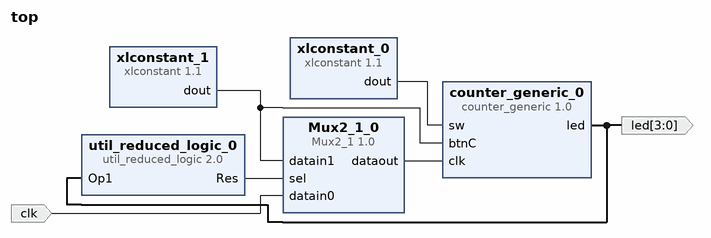
[diagram p0: block diagram of the top level]
# Vivado block design top, xc7a100tcsg324-3, Vivado 2016.4
create_bd_design top

create_bd_port -dir I clk
create_bd_port -dir O -from 3 -to 0 led

create_bd_cell -type ip -vlnv xilinx.com:user:counter_generic:1.0 counter_generic_0
create_bd_cell -type ip -vlnv xilinx.com:ip:xlconstant:1.1 xlconstant_0
set_property -dict {CONFIG.CONST_WIDTH 2} [get_bd_cells xlconstant_0]
create_bd_cell -type ip -vlnv xilinx.com:ip:xlconstant:1.1 xlconstant_1
set_property -dict {CONFIG.CONST_VAL 0} [get_bd_cells xlconstant_1]
create_bd_cell -type ip -vlnv xilinx.com:user:Mux2_1:1.0 Mux2_1_0
set_property -dict {CONFIG.number_of_bits 1} [get_bd_cells Mux2_1_0]
create_bd_cell -type ip -vlnv xilinx.com:ip:util_reduced_logic:2.0 util_reduced_logic_0
set_property -dict {CONFIG.C_SIZE 4} [get_bd_cells util_reduced_logic_0]

# ---- connections ----

connect_bd_net [get_bd_pins xlconstant_0/dout] [get_bd_pins counter_generic_0/sw]
connect_bd_net [get_bd_pins xlconstant_1/dout] [get_bd_pins counter_generic_0/btnC] [get_bd_pins Mux2_1_0/datain1]
connect_bd_net [get_bd_ports clk] [get_bd_pins Mux2_1_0/datain0]
connect_bd_net [get_bd_pins Mux2_1_0/dataout] [get_bd_pins counter_generic_0/clk]
connect_bd_net [get_bd_pins counter_generic_0/led] [get_bd_pins util_reduced_logic_0/Op1] [get_bd_ports led]
connect_bd_net [get_bd_pins util_reduced_logic_0/Res] [get_bd_pins Mux2_1_0/sel]

validate_bd_design
save_bd_design
